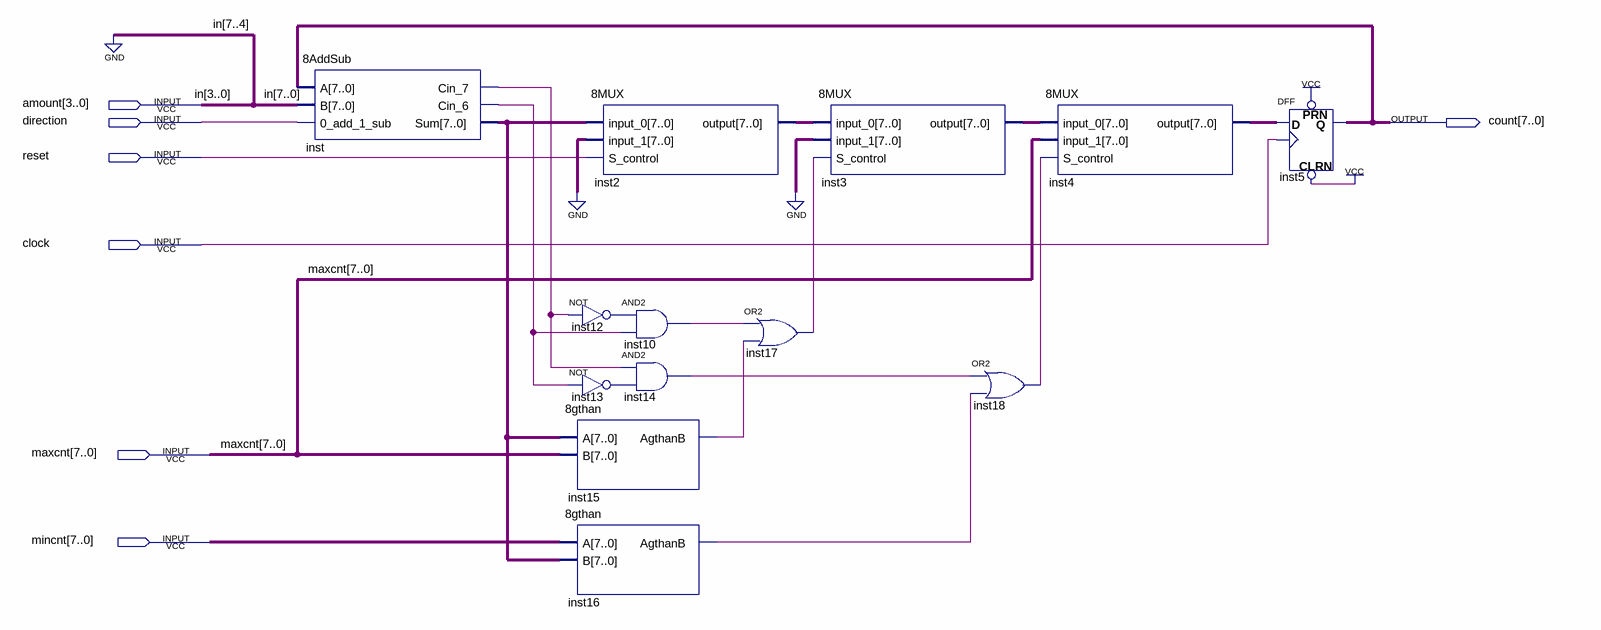
[diagram p0: schematic sheet]
// Quartus schematic counter.bdf as structural Verilog: 13 symbols, 7 pins
module counter (
  input  [3:0] amount,
  input  direction,
  input  reset,
  input  clock,
  input  [7:0] maxcnt,
  input  [7:0] mincnt,
  output [7:0] count
);

  wire inst10_out, inst12_out, inst13_out, inst14_out, inst15_agthanb, inst16_agthanb, inst17_out,
       inst18_out, inst_cin_6, inst_cin_7;
  wire [7:0] inst2_output, inst3_output, inst4_output, inst_sum;

  \8AddSub  inst (
    .A(count), .B({4'b0000, amount}), .\0_add_1_sub (direction), .Cin_7(inst_cin_7), .Cin_6(inst_cin_6),
    .Sum(inst_sum));
  \8gthan  inst15 (.A(inst_sum), .B(maxcnt), .AgthanB(inst15_agthanb));
  \8gthan  inst16 (.A(mincnt), .B(inst_sum), .AgthanB(inst16_agthanb));
  \8MUX  inst2 (.input_0(inst_sum), .input_1({8{1'b0}}), .S_control(reset), .\output (inst2_output));
  and inst10 (inst10_out, inst12_out, inst_cin_6);
  not inst12 (inst12_out, inst_cin_7);
  and inst14 (inst14_out, inst_cin_7, inst13_out);
  not inst13 (inst13_out, inst_cin_6);
  or inst17 (inst17_out, inst10_out, inst15_agthanb);
  \8MUX  inst3 (.input_0(inst2_output), .input_1({8{1'b0}}), .S_control(inst17_out), .\output (inst3_output));
  or inst18 (inst18_out, inst14_out, inst16_agthanb);
  \8MUX  inst4 (.input_0(inst3_output), .input_1(maxcnt), .S_control(inst18_out), .\output (inst4_output));
  DFF inst5[7:0] (.CLRN(1'b1), .CLK(clock), .D(inst4_output), .PRN(1'b1), .Q(count));

  // Other names for the same wires on the sheet: in[3:0] = amount
endmodule
